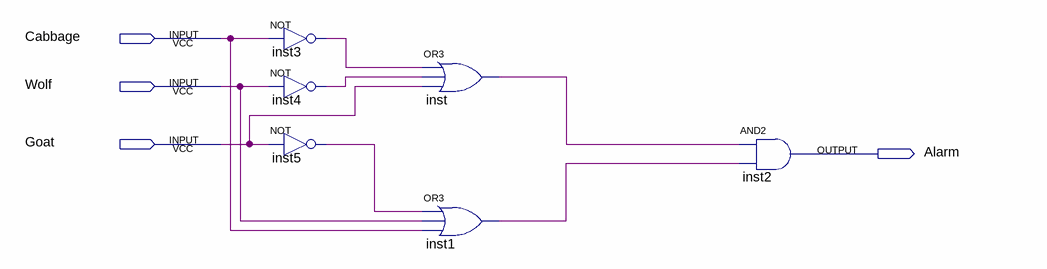
[diagram p0: schematic sheet]
// Quartus schematic lab3Step0.bdf as structural Verilog: 6 symbols, 4 pins
module lab3Step0 (
  input  Cabbage,
  input  Wolf,
  input  Goat,
  output Alarm
);

  wire inst1_out, inst3_out, inst4_out, inst5_out, inst_out;

  not inst3 (inst3_out, Cabbage);
  not inst4 (inst4_out, Wolf);
  not inst5 (inst5_out, Goat);
  or inst (inst_out, inst3_out, inst4_out, Goat);
  or inst1 (inst1_out, inst5_out, Wolf, Cabbage);
  and inst2 (Alarm, inst_out, inst1_out);
endmodule
